# EasyEDA schematic shematicEASYEDA.json
TITLE: Sheet_2; REV: 1.0; Date: 2025-11-01; Sheet: 1/1; Drawn By: codingme313; Company: Your Company
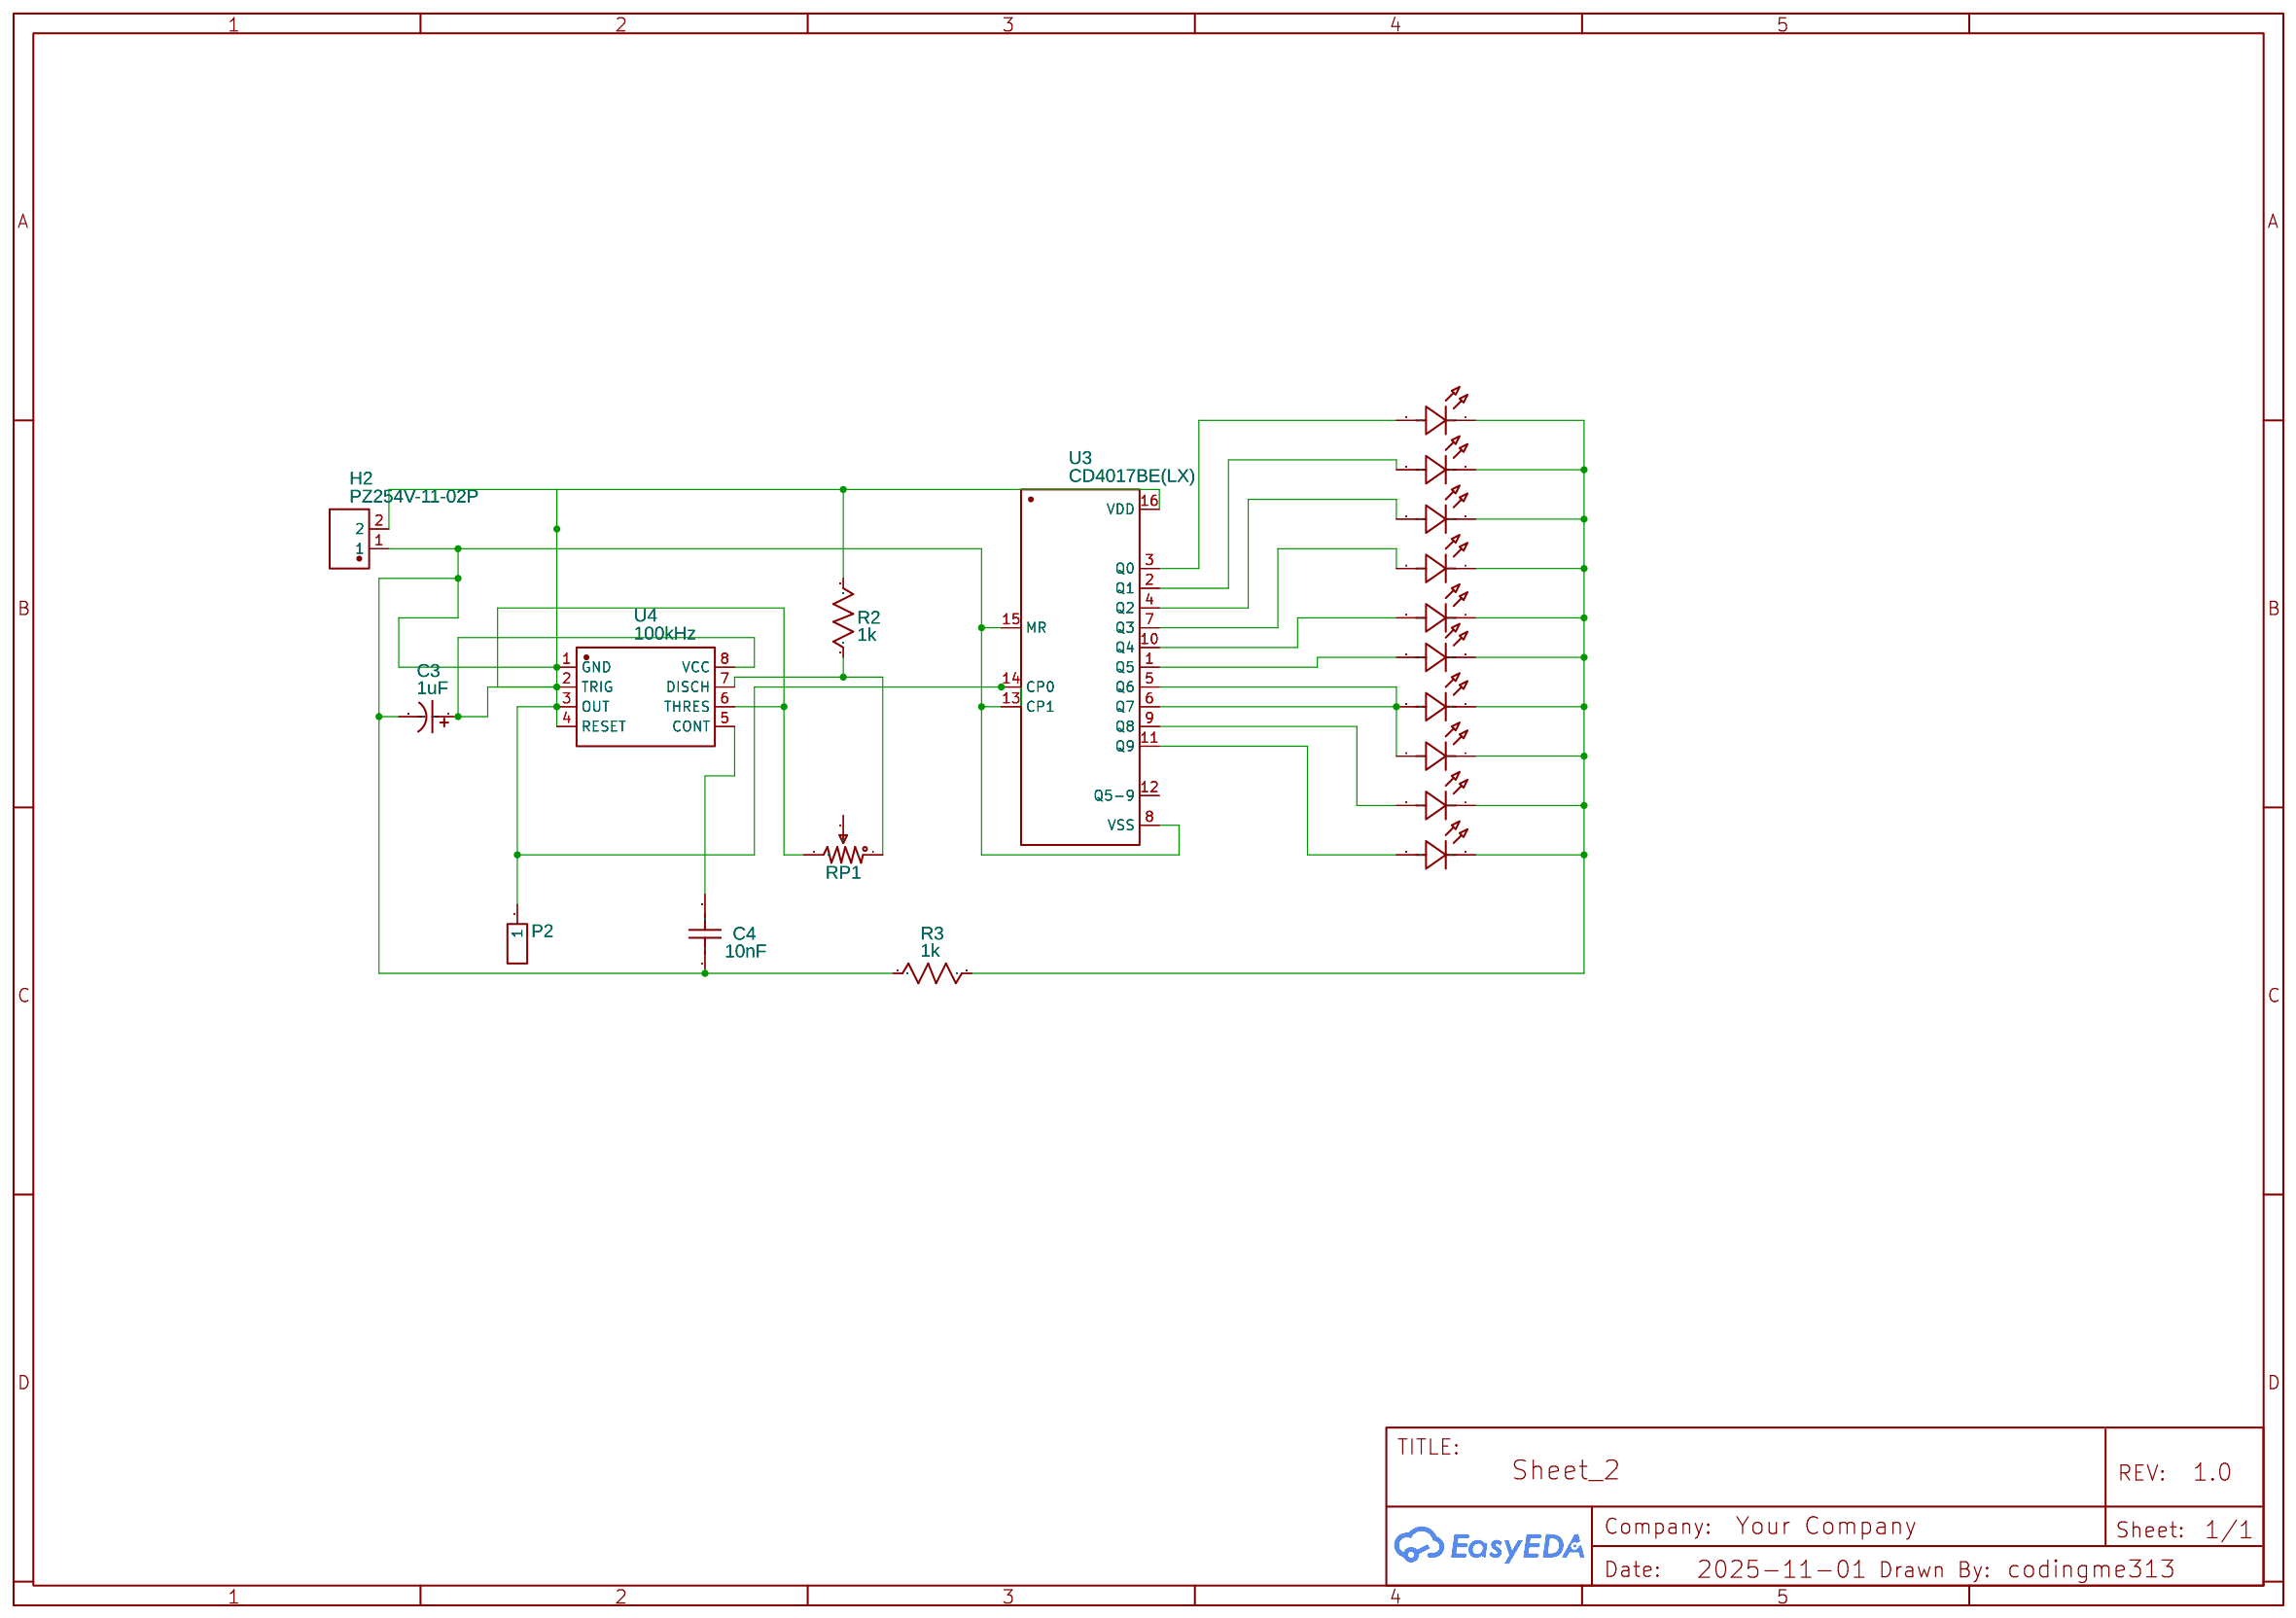
[diagram p0: schematic sheet]

## Parts
C3  1uF  [CAP-TH_BD5.0-P2.00-D0.8-FD]
C4  10nF  [CAP-TH_L8.0-W4.0-P5.00-D1.2]
H2  PZ254V-11-02P  [HDR-TH_2P-P2.54-V-M]
LED1  XL-502UWC  [LED-TH_BD5.9-P2.54-RD_WHITE]
LED2  XL-502UWC  [LED-TH_BD5.9-P2.54-RD_WHITE]
LED3  XL-502UWC  [LED-TH_BD5.9-P2.54-RD_WHITE]
LED4  XL-502UWC  [LED-TH_BD5.9-P2.54-RD_WHITE]
LED5  XL-502UWC  [LED-TH_BD5.9-P2.54-RD_WHITE]
LED6  XL-502UWC  [LED-TH_BD5.9-P2.54-RD_WHITE]
LED7  XL-502UWC  [LED-TH_BD5.9-P2.54-RD_WHITE]
LED8  XL-502UWC  [LED-TH_BD5.9-P2.54-RD_WHITE]
LED9  XL-502UWC  [LED-TH_BD5.9-P2.54-RD_WHITE]
LED12  XL-502UWC  [LED-TH_BD5.9-P2.54-RD_WHITE]
P2  Header-Male-2.54_1x1  [HDR-TH_1P-P2.54-V-M]
R2  1k  [R0603]
R3  1k  [R0603]
RP1  R_3386P_US  [RES-ADJ-TH_3386P]
U3  CD4017BE(LX)  [PDIP-16_L19.3-W6.4-P2.54-LS7.94-BL]
U4  100kHz  [DIP-8_L9.8-W6.6-P2.54-LS7.6-BL]

## Library data of the parts
C3 = KF010M050C110A: Supplier: LCSC; Manufacturer: CapXon(丰宾); Supplier Part: C62934; JLCPCB Part Class: Extended Part
C4 = N09F1B103MN0B0S0N0: Contributor: LCSC; Supplier: LCSC; Supplier Part: C249157; Manufacturer: STE(松田); JLCPCB Part Class: Extended Part
H2 = PZ254V-11-02P: Contributor: LCSC; Supplier: LCSC; Supplier Part: C492401; Manufacturer: XFCN(兴飞); JLCPCB Part Class: Extended Part
LED1-LED9 LED12 = XL-502UWC: Contributor: LCSC; Supplier: LCSC; Supplier Part: C2895480; Manufacturer: XINGLIGHT(成兴光); JLCPCB Part Class: Extended Part
P2 = Header-Male-2.54_1x1: Supplier: LCSC; Manufacturer: BOOMELE(博穆精密); Manufacturer Part: 2.54-1*1P针; Supplier Part: C81276; JLCPCB Part Class: Extended Part
R2 R3 = R_0603_US: Contributor: LCEDA_Lib
RP1 = R_3386P_US: Supplier: LCSC; Contributor: LCEDA_Lib; value(Ω): 10K
U3 = CD4017BE(LX): Supplier: LCSC; Supplier Part: C32710674; Manufacturer: LX(灵星芯微); Contributor: lcsc; JLCPCB Part Class: Extended Part
U4 = NE555P: Supplier: LCSC; Manufacturer: TI(德州仪器); Supplier Part: C46749; JLCPCB Part Class: Extended Part

## Nets
Net-(C3-1): C3.1 C3.2 C4.1 H2.1 H2.2 P2.1 R2.2 R3.2 RP1.3 U3.8(VSS) U3.13(CP1) U3.14(CP0) U3.15(MR) U3.16(VDD) U4.1(GND) U4.2(TRIG) U4.3(OUT) U4.4(RESET) U4.6(THRES) U4.8(VCC)
Net-(C4-2): C4.2 U4.5(CONT)
Net-(LED1-1): LED1.1(K) LED2.1(K) LED3.1(K) LED4.1(K) LED5.1(K) LED6.1(K) LED7.1(K) LED8.1(K) LED9.1(K) LED12.1(K) R3.1
Net-(LED1-2): LED1.2(A) U3.2(Q1)
Net-(LED2-2): LED2.2(A) U3.4(Q2)
Net-(LED3-2): LED3.2(A) U3.7(Q3)
Net-(LED4-2): LED4.2(A) U3.10(Q4)
Net-(LED5-2): LED5.2(A) U3.1(Q5)
Net-(LED6-2): LED6.2(A) LED7.2(A) U3.5(Q6) U3.6(Q7)
Net-(LED8-2): LED8.2(A) U3.9(Q8)
Net-(LED9-2): LED9.2(A) U3.11(Q9)
Net-(LED12-2): LED12.2(A) U3.3(Q0)
Net-(R2-1): R2.1 RP1.1 U4.7(DISCH)

Not connected (* = marked no-connect by the designer): RP1 2; U3 12(Q5-9)
